# Altium schematic sheet Sheet1.SchDoc
size A
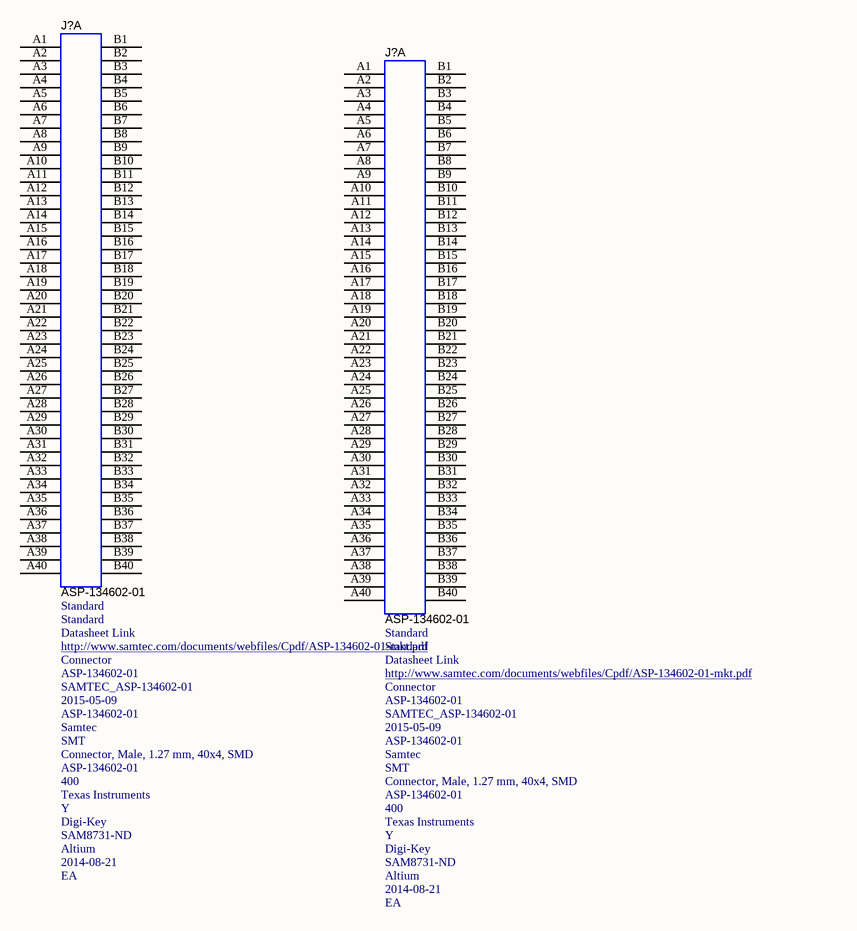
[diagram p0: Sheet1.SchDoc]

## Parts
(Parts that share a designator on the sheet are numbered #1, #2 ... from top to bottom, then left to right.)
J?#1  ASP-134602-01  Component Kind: Standard  ComponentLink1Description: Datasheet Link  CompType: Connector  LatestRevisionDate: 2015-05-09  Manufacturer: Samtec  MountType: SMT  Pin Count: 400  Publisher: Texas Instruments  RoHS: Y  Supplier 1: Digi-Key  Supplier Part Number 1: SAM8731-ND  SymbolCreator: Altium  SymbolVersion: 2014-08-21  U/M: EA  [SAMTEC_ASP-134602-01]  (part A of 5)
J?#2  ASP-134602-01  Component Kind: Standard  ComponentLink1Description: Datasheet Link  CompType: Connector  LatestRevisionDate: 2015-05-09  Manufacturer: Samtec  MountType: SMT  Pin Count: 400  Publisher: Texas Instruments  RoHS: Y  Supplier 1: Digi-Key  Supplier Part Number 1: SAM8731-ND  SymbolCreator: Altium  SymbolVersion: 2014-08-21  U/M: EA  [SAMTEC_ASP-134602-01]  (part A of 5)

## Nets

Not connected (* = marked no-connect by the designer): J?#1 A1 A2 A3 A4 A5 A6 A7 A8 A9 A10 A11 A12 A13 A14 A15 A16 A17 A18 A19 A20 A21 A22 A23 A24 A25 A26 A27 A28 A29 A30 A31 A32 A33 A34 A35 A36 A37 A38 A39 A40 B1 B2 B3 B4 B5 B6 B7 B8 B9 B10 B11 B12 B13 B14 B15 B16 B17 B18 B19 B20 B21 B22 B23 B24 B25 B26 B27 B28 B29 B30 B31 B32 B33 B34 B35 B36 B37 B38 B39 B40; J?#2 A1 A2 A3 A4 A5 A6 A7 A8 A9 A10 A11 A12 A13 A14 A15 A16 A17 A18 A19 A20 A21 A22 A23 A24 A25 A26 A27 A28 A29 A30 A31 A32 A33 A34 A35 A36 A37 A38 A39 A40 B1 B2 B3 B4 B5 B6 B7 B8 B9 B10 B11 B12 B13 B14 B15 B16 B17 B18 B19 B20 B21 B22 B23 B24 B25 B26 B27 B28 B29 B30 B31 B32 B33 B34 B35 B36 B37 B38 B39 B40

## Library data of the parts
J?#1 J?#2 = ASP-134602-01: Connector, Male, 1.27 mm, 40x4, SMD; Part Number: ASP-134602-01; Component Type: Standard; ComponentLink1URL: http://www.samtec.com/documents/webfiles/Cpdf/ASP-134602-01-mkt.pdf; Designator: ASP-134602-01; PackageReference: Connector, Male, 1.27 mm, 40x4, SMD; PartNumber: ASP-134602-01